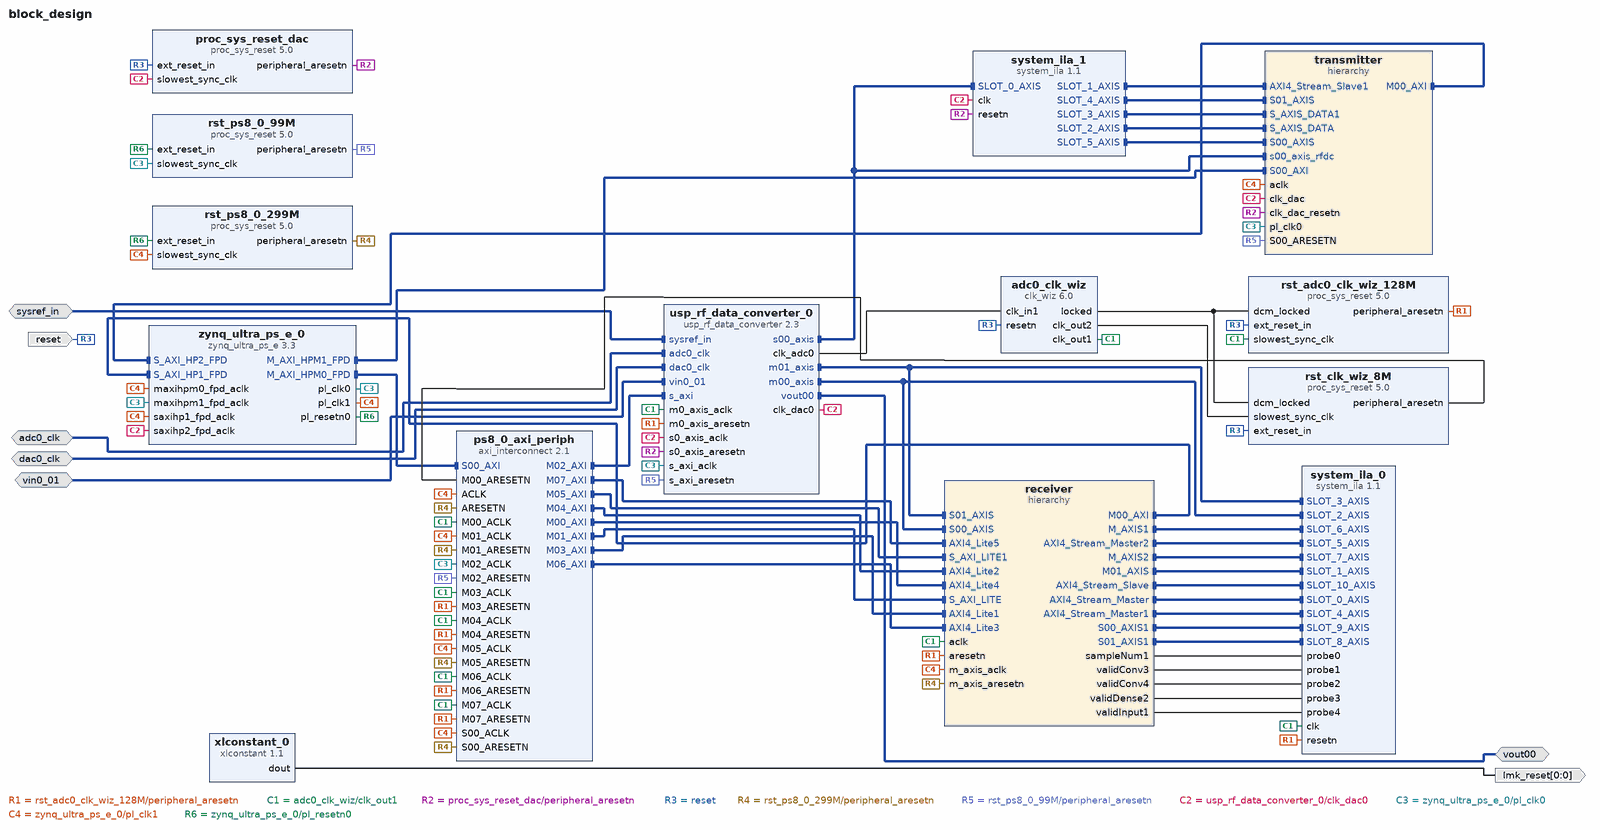
[diagram p0: block diagram of the top level]
# Vivado block design block_design, xczu28dr-ffvg1517-2-e, Vivado 2020.1
create_bd_design block_design

create_bd_intf_port -mode Slave -vlnv xilinx.com:interface:diff_clock_rtl:1.0 adc0_clk
set_property -dict {CONFIG.FREQ_HZ 409600000.0} [get_bd_intf_ports adc0_clk]
create_bd_intf_port -mode Slave -vlnv xilinx.com:interface:diff_clock_rtl:1.0 dac0_clk
set_property -dict {CONFIG.FREQ_HZ 409600000.0} [get_bd_intf_ports dac0_clk]
create_bd_intf_port -mode Slave -vlnv xilinx.com:display_usp_rf_data_converter:diff_pins_rtl:1.0 sysref_in
create_bd_intf_port -mode Slave -vlnv xilinx.com:interface:diff_analog_io_rtl:1.0 vin0_01
create_bd_intf_port -mode Master -vlnv xilinx.com:interface:diff_analog_io_rtl:1.0 vout00
create_bd_port -dir O -from 0 -to 0 lmk_reset
create_bd_port -dir I -type rst reset

create_bd_cell -type ip -vlnv xilinx.com:ip:clk_wiz:6.0 adc0_clk_wiz
set_property -dict [list \
  CONFIG.CLKOUT1_JITTER 135.584 \
  CONFIG.CLKOUT1_PHASE_ERROR 114.796 \
  CONFIG.CLKOUT1_REQUESTED_OUT_FREQ 128.000 \
  CONFIG.CLKOUT2_JITTER 251.912 \
  CONFIG.CLKOUT2_PHASE_ERROR 114.796 \
  CONFIG.CLKOUT2_REQUESTED_OUT_FREQ 8 \
  CONFIG.CLKOUT2_USED true \
  CONFIG.MMCM_CLKFBOUT_MULT_F 16.000 \
  CONFIG.MMCM_CLKOUT0_DIVIDE_F 8.000 \
  CONFIG.MMCM_CLKOUT1_DIVIDE 128 \
  CONFIG.NUM_OUT_CLKS 2 \
  CONFIG.PRIM_IN_FREQ 64.000 \
  CONFIG.RESET_PORT resetn \
  CONFIG.RESET_TYPE ACTIVE_LOW \
  CONFIG.USE_LOCKED true \
] [get_bd_cells adc0_clk_wiz]
create_bd_cell -type ip -vlnv xilinx.com:ip:proc_sys_reset:5.0 proc_sys_reset_dac
create_bd_cell -type ip -vlnv xilinx.com:ip:axi_interconnect:2.1 ps8_0_axi_periph
set_property -dict {CONFIG.NUM_MI 8} [get_bd_cells ps8_0_axi_periph]
create_bd_cell -type hier receiver
create_bd_cell -type ip -vlnv xilinx.com:ip:proc_sys_reset:5.0 rst_adc0_clk_wiz_128M
create_bd_cell -type ip -vlnv xilinx.com:ip:proc_sys_reset:5.0 rst_clk_wiz_8M
create_bd_cell -type ip -vlnv xilinx.com:ip:proc_sys_reset:5.0 rst_ps8_0_299M
create_bd_cell -type ip -vlnv xilinx.com:ip:proc_sys_reset:5.0 rst_ps8_0_99M
create_bd_cell -type ip -vlnv xilinx.com:ip:system_ila:1.1 system_ila_0
set_property -dict [list \
  CONFIG.C_DATA_DEPTH 4096 \
  CONFIG.C_MON_TYPE MIX \
  CONFIG.C_NUM_MONITOR_SLOTS 11 \
  CONFIG.C_NUM_OF_PROBES 5 \
  CONFIG.C_PROBE0_TYPE 0 \
  CONFIG.C_PROBE1_TYPE 0 \
  CONFIG.C_PROBE2_TYPE 0 \
  CONFIG.C_PROBE3_TYPE 0 \
  CONFIG.C_PROBE4_TYPE 0 \
  CONFIG.C_SLOT_0_APC_EN 0 \
  CONFIG.C_SLOT_0_AXI_DATA_SEL 1 \
  CONFIG.C_SLOT_0_AXI_TRIG_SEL 1 \
  CONFIG.C_SLOT_0_INTF_TYPE xilinx.com:interface:axis_rtl:1.0 \
  CONFIG.C_SLOT_10_APC_EN 0 \
  CONFIG.C_SLOT_10_AXI_DATA_SEL 1 \
  CONFIG.C_SLOT_10_AXI_TRIG_SEL 1 \
  CONFIG.C_SLOT_10_INTF_TYPE xilinx.com:interface:axis_rtl:1.0 \
  CONFIG.C_SLOT_1_APC_EN 0 \
  CONFIG.C_SLOT_1_AXI_DATA_SEL 1 \
  CONFIG.C_SLOT_1_AXI_TRIG_SEL 1 \
  CONFIG.C_SLOT_1_INTF_TYPE xilinx.com:interface:axis_rtl:1.0 \
  CONFIG.C_SLOT_2_APC_EN 0 \
  CONFIG.C_SLOT_2_AXI_DATA_SEL 1 \
  CONFIG.C_SLOT_2_AXI_TRIG_SEL 1 \
  CONFIG.C_SLOT_2_INTF_TYPE xilinx.com:interface:axis_rtl:1.0 \
  CONFIG.C_SLOT_3_APC_EN 0 \
  CONFIG.C_SLOT_3_AXI_DATA_SEL 1 \
  CONFIG.C_SLOT_3_AXI_TRIG_SEL 1 \
  CONFIG.C_SLOT_3_INTF_TYPE xilinx.com:interface:axis_rtl:1.0 \
  CONFIG.C_SLOT_4_APC_EN 0 \
  CONFIG.C_SLOT_4_AXI_DATA_SEL 1 \
  CONFIG.C_SLOT_4_AXI_TRIG_SEL 1 \
  CONFIG.C_SLOT_4_INTF_TYPE xilinx.com:interface:axis_rtl:1.0 \
  CONFIG.C_SLOT_5_APC_EN 0 \
  CONFIG.C_SLOT_5_AXI_DATA_SEL 1 \
  CONFIG.C_SLOT_5_AXI_TRIG_SEL 1 \
  CONFIG.C_SLOT_5_INTF_TYPE xilinx.com:interface:axis_rtl:1.0 \
  CONFIG.C_SLOT_6_APC_EN 0 \
  CONFIG.C_SLOT_6_AXI_DATA_SEL 1 \
  CONFIG.C_SLOT_6_AXI_TRIG_SEL 1 \
  CONFIG.C_SLOT_6_INTF_TYPE xilinx.com:interface:axis_rtl:1.0 \
  CONFIG.C_SLOT_7_APC_EN 0 \
  CONFIG.C_SLOT_7_AXI_DATA_SEL 1 \
  CONFIG.C_SLOT_7_AXI_TRIG_SEL 1 \
  CONFIG.C_SLOT_7_INTF_TYPE xilinx.com:interface:axis_rtl:1.0 \
  CONFIG.C_SLOT_8_APC_EN 0 \
  CONFIG.C_SLOT_8_AXI_DATA_SEL 1 \
  CONFIG.C_SLOT_8_AXI_TRIG_SEL 1 \
  CONFIG.C_SLOT_8_INTF_TYPE xilinx.com:interface:axis_rtl:1.0 \
  CONFIG.C_SLOT_9_APC_EN 0 \
  CONFIG.C_SLOT_9_AXI_DATA_SEL 1 \
  CONFIG.C_SLOT_9_AXI_TRIG_SEL 1 \
  CONFIG.C_SLOT_9_INTF_TYPE xilinx.com:interface:axis_rtl:1.0 \
] [get_bd_cells system_ila_0]
create_bd_cell -type ip -vlnv xilinx.com:ip:system_ila:1.1 system_ila_1
set_property -dict [list \
  CONFIG.C_MON_TYPE INTERFACE \
  CONFIG.C_NUM_MONITOR_SLOTS 6 \
  CONFIG.C_SLOT_0_APC_EN 0 \
  CONFIG.C_SLOT_0_AXI_DATA_SEL 1 \
  CONFIG.C_SLOT_0_AXI_TRIG_SEL 1 \
  CONFIG.C_SLOT_0_INTF_TYPE xilinx.com:interface:axis_rtl:1.0 \
  CONFIG.C_SLOT_1_APC_EN 0 \
  CONFIG.C_SLOT_1_AXI_DATA_SEL 1 \
  CONFIG.C_SLOT_1_AXI_TRIG_SEL 1 \
  CONFIG.C_SLOT_1_INTF_TYPE xilinx.com:interface:axis_rtl:1.0 \
  CONFIG.C_SLOT_2_APC_EN 0 \
  CONFIG.C_SLOT_2_AXI_DATA_SEL 1 \
  CONFIG.C_SLOT_2_AXI_TRIG_SEL 1 \
  CONFIG.C_SLOT_2_INTF_TYPE xilinx.com:interface:axis_rtl:1.0 \
  CONFIG.C_SLOT_3_APC_EN 0 \
  CONFIG.C_SLOT_3_AXI_DATA_SEL 1 \
  CONFIG.C_SLOT_3_AXI_TRIG_SEL 1 \
  CONFIG.C_SLOT_3_INTF_TYPE xilinx.com:interface:axis_rtl:1.0 \
  CONFIG.C_SLOT_4_APC_EN 0 \
  CONFIG.C_SLOT_4_AXI_DATA_SEL 1 \
  CONFIG.C_SLOT_4_AXI_TRIG_SEL 1 \
  CONFIG.C_SLOT_4_INTF_TYPE xilinx.com:interface:axis_rtl:1.0 \
  CONFIG.C_SLOT_5_APC_EN 0 \
  CONFIG.C_SLOT_5_AXI_DATA_SEL 1 \
  CONFIG.C_SLOT_5_AXI_TRIG_SEL 1 \
  CONFIG.C_SLOT_5_INTF_TYPE xilinx.com:interface:axis_rtl:1.0 \
] [get_bd_cells system_ila_1]
create_bd_cell -type hier transmitter
create_bd_cell -type ip -vlnv xilinx.com:ip:usp_rf_data_converter:2.3 usp_rf_data_converter_0
set_property -dict [list \
  CONFIG.ADC0_Outclk_Freq 64.000 \
  CONFIG.ADC0_PLL_Enable true \
  CONFIG.ADC0_Refclk_Freq 409.600 \
  CONFIG.ADC0_Sampling_Rate 1.024 \
  CONFIG.ADC_Data_Type00 1 \
  CONFIG.ADC_Data_Width00 1 \
  CONFIG.ADC_Decimation_Mode00 8 \
  CONFIG.ADC_Dither00 false \
  CONFIG.ADC_Mixer_Mode00 0 \
  CONFIG.ADC_Mixer_Type00 1 \
  CONFIG.ADC_Mixer_Type01 1 \
  CONFIG.ADC_Slice00_Enable true \
  CONFIG.DAC0_Outclk_Freq 128.000 \
  CONFIG.DAC0_PLL_Enable true \
  CONFIG.DAC0_Refclk_Freq 409.600 \
  CONFIG.DAC0_Sampling_Rate 1.024 \
  CONFIG.DAC_Data_Width00 2 \
  CONFIG.DAC_Interpolation_Mode00 8 \
  CONFIG.DAC_Mixer_Mode00 0 \
  CONFIG.DAC_Mixer_Type00 2 \
  CONFIG.DAC_Slice00_Enable true \
  CONFIG.DAC_Slice01_Enable false \
  CONFIG.DAC_Slice10_Enable false \
  CONFIG.DAC_Slice12_Enable false \
  CONFIG.DAC_Slice13_Enable false \
] [get_bd_cells usp_rf_data_converter_0]
create_bd_cell -type ip -vlnv xilinx.com:ip:xlconstant:1.1 xlconstant_0
set_property -dict {CONFIG.CONST_VAL 0} [get_bd_cells xlconstant_0]
create_bd_cell -type ip -vlnv xilinx.com:ip:zynq_ultra_ps_e:3.3 zynq_ultra_ps_e_0
set_property -dict [list \
  CONFIG.CAN0_BOARD_INTERFACE custom \
  CONFIG.CAN1_BOARD_INTERFACE custom \
  CONFIG.CSU_BOARD_INTERFACE custom \
  CONFIG.DP_BOARD_INTERFACE custom \
  CONFIG.GEM0_BOARD_INTERFACE custom \
  CONFIG.GEM1_BOARD_INTERFACE custom \
  CONFIG.GEM2_BOARD_INTERFACE custom \
  CONFIG.GEM3_BOARD_INTERFACE custom \
  CONFIG.GPIO_BOARD_INTERFACE custom \
  CONFIG.IIC0_BOARD_INTERFACE custom \
  CONFIG.IIC1_BOARD_INTERFACE custom \
  CONFIG.NAND_BOARD_INTERFACE custom \
  CONFIG.PCIE_BOARD_INTERFACE custom \
  CONFIG.PJTAG_BOARD_INTERFACE custom \
  CONFIG.PMU_BOARD_INTERFACE custom \
  CONFIG.PSU_BANK_0_IO_STANDARD LVCMOS18 \
  CONFIG.PSU_BANK_1_IO_STANDARD LVCMOS18 \
  CONFIG.PSU_BANK_2_IO_STANDARD LVCMOS18 \
  CONFIG.PSU_BANK_3_IO_STANDARD LVCMOS33 \
  CONFIG.PSU_USB3__DUAL_CLOCK_ENABLE 1 \
  CONFIG.PSU__CAN1__PERIPHERAL__ENABLE 0 \
  CONFIG.PSU__CRF_APB__ACPU_CTRL__FREQMHZ 1200 \
  CONFIG.PSU__CRF_APB__ACPU_CTRL__SRCSEL APLL \
  CONFIG.PSU__CRF_APB__APLL_CTRL__SRCSEL PSS_REF_CLK \
  CONFIG.PSU__CRF_APB__DBG_FPD_CTRL__FREQMHZ 250 \
  CONFIG.PSU__CRF_APB__DBG_FPD_CTRL__SRCSEL IOPLL \
  CONFIG.PSU__CRF_APB__DBG_TRACE_CTRL__FREQMHZ 250 \
  CONFIG.PSU__CRF_APB__DBG_TRACE_CTRL__SRCSEL IOPLL \
  CONFIG.PSU__CRF_APB__DBG_TSTMP_CTRL__FREQMHZ 250 \
  CONFIG.PSU__CRF_APB__DBG_TSTMP_CTRL__SRCSEL IOPLL \
  CONFIG.PSU__CRF_APB__DDR_CTRL__FREQMHZ 1067 \
  CONFIG.PSU__CRF_APB__DDR_CTRL__SRCSEL DPLL \
  CONFIG.PSU__CRF_APB__DPDMA_REF_CTRL__FREQMHZ 600 \
  CONFIG.PSU__CRF_APB__DPDMA_REF_CTRL__SRCSEL APLL \
  CONFIG.PSU__CRF_APB__DPLL_CTRL__SRCSEL PSS_REF_CLK \
  CONFIG.PSU__CRF_APB__DP_AUDIO_REF_CTRL__SRCSEL RPLL \
  CONFIG.PSU__CRF_APB__DP_STC_REF_CTRL__SRCSEL RPLL \
  CONFIG.PSU__CRF_APB__DP_VIDEO_REF_CTRL__SRCSEL VPLL \
  CONFIG.PSU__CRF_APB__GDMA_REF_CTRL__FREQMHZ 600 \
  CONFIG.PSU__CRF_APB__GDMA_REF_CTRL__SRCSEL APLL \
  CONFIG.PSU__CRF_APB__GPU_REF_CTRL__FREQMHZ 500 \
  CONFIG.PSU__CRF_APB__GPU_REF_CTRL__SRCSEL IOPLL \
  CONFIG.PSU__CRF_APB__TOPSW_LSBUS_CTRL__FREQMHZ 100 \
  CONFIG.PSU__CRF_APB__TOPSW_LSBUS_CTRL__SRCSEL IOPLL \
  CONFIG.PSU__CRF_APB__TOPSW_MAIN_CTRL__FREQMHZ 533.33 \
  CONFIG.PSU__CRF_APB__TOPSW_MAIN_CTRL__SRCSEL DPLL \
  CONFIG.PSU__CRF_APB__VPLL_CTRL__SRCSEL PSS_REF_CLK \
  CONFIG.PSU__CRL_APB__ADMA_REF_CTRL__FREQMHZ 500 \
  CONFIG.PSU__CRL_APB__ADMA_REF_CTRL__SRCSEL IOPLL \
  CONFIG.PSU__CRL_APB__CAN1_REF_CTRL__FREQMHZ 100 \
  CONFIG.PSU__CRL_APB__CAN1_REF_CTRL__SRCSEL IOPLL \
  CONFIG.PSU__CRL_APB__CPU_R5_CTRL__FREQMHZ 500 \
  CONFIG.PSU__CRL_APB__CPU_R5_CTRL__SRCSEL IOPLL \
  CONFIG.PSU__CRL_APB__DBG_LPD_CTRL__FREQMHZ 250 \
  CONFIG.PSU__CRL_APB__DBG_LPD_CTRL__SRCSEL IOPLL \
  CONFIG.PSU__CRL_APB__GEM3_REF_CTRL__FREQMHZ 125 \
  CONFIG.PSU__CRL_APB__GEM3_REF_CTRL__SRCSEL IOPLL \
  CONFIG.PSU__CRL_APB__I2C0_REF_CTRL__FREQMHZ 100 \
  CONFIG.PSU__CRL_APB__I2C0_REF_CTRL__SRCSEL IOPLL \
  CONFIG.PSU__CRL_APB__I2C1_REF_CTRL__FREQMHZ 100 \
  CONFIG.PSU__CRL_APB__I2C1_REF_CTRL__SRCSEL IOPLL \
  CONFIG.PSU__CRL_APB__IOPLL_CTRL__SRCSEL PSS_REF_CLK \
  CONFIG.PSU__CRL_APB__IOU_SWITCH_CTRL__FREQMHZ 250 \
  CONFIG.PSU__CRL_APB__IOU_SWITCH_CTRL__SRCSEL IOPLL \
  CONFIG.PSU__CRL_APB__LPD_LSBUS_CTRL__FREQMHZ 100 \
  CONFIG.PSU__CRL_APB__LPD_LSBUS_CTRL__SRCSEL IOPLL \
  CONFIG.PSU__CRL_APB__LPD_SWITCH_CTRL__FREQMHZ 500 \
  CONFIG.PSU__CRL_APB__LPD_SWITCH_CTRL__SRCSEL IOPLL \
  CONFIG.PSU__CRL_APB__PCAP_CTRL__FREQMHZ 200 \
  CONFIG.PSU__CRL_APB__PCAP_CTRL__SRCSEL IOPLL \
  CONFIG.PSU__CRL_APB__PL0_REF_CTRL__FREQMHZ 100 \
  CONFIG.PSU__CRL_APB__PL0_REF_CTRL__SRCSEL IOPLL \
  CONFIG.PSU__CRL_APB__PL1_REF_CTRL__FREQMHZ 300 \
  CONFIG.PSU__CRL_APB__PL1_REF_CTRL__SRCSEL IOPLL \
  CONFIG.PSU__CRL_APB__QSPI_REF_CTRL__FREQMHZ 125 \
  CONFIG.PSU__CRL_APB__QSPI_REF_CTRL__SRCSEL IOPLL \
  CONFIG.PSU__CRL_APB__RPLL_CTRL__SRCSEL PSS_REF_CLK \
  CONFIG.PSU__CRL_APB__SDIO1_REF_CTRL__FREQMHZ 200 \
  CONFIG.PSU__CRL_APB__SDIO1_REF_CTRL__SRCSEL IOPLL \
  CONFIG.PSU__CRL_APB__TIMESTAMP_REF_CTRL__FREQMHZ 100 \
  CONFIG.PSU__CRL_APB__TIMESTAMP_REF_CTRL__SRCSEL IOPLL \
  CONFIG.PSU__CRL_APB__UART0_REF_CTRL__FREQMHZ 100 \
  CONFIG.PSU__CRL_APB__UART0_REF_CTRL__SRCSEL IOPLL \
  CONFIG.PSU__CRL_APB__UART1_REF_CTRL__FREQMHZ 100 \
  CONFIG.PSU__CRL_APB__UART1_REF_CTRL__SRCSEL IOPLL \
  CONFIG.PSU__CRL_APB__USB0_BUS_REF_CTRL__FREQMHZ 250 \
  CONFIG.PSU__CRL_APB__USB0_BUS_REF_CTRL__SRCSEL IOPLL \
  CONFIG.PSU__CRL_APB__USB3_DUAL_REF_CTRL__FREQMHZ 20 \
  CONFIG.PSU__CRL_APB__USB3_DUAL_REF_CTRL__SRCSEL IOPLL \
  CONFIG.PSU__CRL_APB__USB3__ENABLE 1 \
  CONFIG.PSU__CSUPMU__PERIPHERAL__VALID 1 \
  CONFIG.PSU__DDRC__BUS_WIDTH {64 Bit} \
  CONFIG.PSU__DDRC__COMPONENTS UDIMM \
  CONFIG.PSU__DDRC__DEVICE_CAPACITY {8192 MBits} \
  CONFIG.PSU__DDRC__DRAM_WIDTH {16 Bits} \
  CONFIG.PSU__DDRC__ECC Disabled \
  CONFIG.PSU__DDRC__MEMORY_TYPE {DDR 4} \
  CONFIG.PSU__DDRC__SPEED_BIN DDR4_2133P \
  CONFIG.PSU__DDR_HIGH_ADDRESS_GUI_ENABLE 1 \
  CONFIG.PSU__DDR__INTERFACE__FREQMHZ 533.500 \
  CONFIG.PSU__DEVICE_TYPE RFSOC \
  CONFIG.PSU__DISPLAYPORT__LANE0__ENABLE 1 \
  CONFIG.PSU__DISPLAYPORT__LANE0__IO {GT Lane1} \
  CONFIG.PSU__DISPLAYPORT__LANE1__ENABLE 1 \
  CONFIG.PSU__DISPLAYPORT__LANE1__IO {GT Lane0} \
  CONFIG.PSU__DISPLAYPORT__PERIPHERAL__ENABLE 1 \
  CONFIG.PSU__DLL__ISUSED 1 \
  CONFIG.PSU__DPAUX__PERIPHERAL__ENABLE 1 \
  CONFIG.PSU__DPAUX__PERIPHERAL__IO {MIO 27 .. 30} \
  CONFIG.PSU__DP__LANE_SEL {Dual Lower} \
  CONFIG.PSU__DP__REF_CLK_FREQ 27 \
  CONFIG.PSU__DP__REF_CLK_SEL {Ref Clk1} \
  CONFIG.PSU__ENET3__FIFO__ENABLE 0 \
  CONFIG.PSU__ENET3__GRP_MDIO__ENABLE 1 \
  CONFIG.PSU__ENET3__GRP_MDIO__IO {MIO 76 .. 77} \
  CONFIG.PSU__ENET3__PERIPHERAL__ENABLE 1 \
  CONFIG.PSU__ENET3__PERIPHERAL__IO {MIO 64 .. 75} \
  CONFIG.PSU__ENET3__PTP__ENABLE 0 \
  CONFIG.PSU__ENET3__TSU__ENABLE 0 \
  CONFIG.PSU__FPGA_PL0_ENABLE 1 \
  CONFIG.PSU__FPGA_PL1_ENABLE 1 \
  CONFIG.PSU__GEM3_COHERENCY 0 \
  CONFIG.PSU__GEM3_ROUTE_THROUGH_FPD 0 \
  CONFIG.PSU__GEM__TSU__ENABLE 0 \
  CONFIG.PSU__GPIO0_MIO__IO {MIO 0 .. 25} \
  CONFIG.PSU__GPIO0_MIO__PERIPHERAL__ENABLE 1 \
  CONFIG.PSU__GPIO1_MIO__IO {MIO 26 .. 51} \
  CONFIG.PSU__GPIO1_MIO__PERIPHERAL__ENABLE 1 \
  CONFIG.PSU__GPU_PP0__POWER__ON 0 \
  CONFIG.PSU__GPU_PP1__POWER__ON 0 \
  CONFIG.PSU__GT__LINK_SPEED HBR \
  CONFIG.PSU__GT__PRE_EMPH_LVL_4 0 \
  CONFIG.PSU__GT__VLT_SWNG_LVL_4 0 \
  CONFIG.PSU__I2C0__PERIPHERAL__ENABLE 1 \
  CONFIG.PSU__I2C0__PERIPHERAL__IO {MIO 14 .. 15} \
  CONFIG.PSU__I2C1__PERIPHERAL__ENABLE 1 \
  CONFIG.PSU__I2C1__PERIPHERAL__IO {MIO 16 .. 17} \
  CONFIG.PSU__IOU_SLCR__IOU_TTC_APB_CLK__TTC0_SEL APB \
  CONFIG.PSU__IOU_SLCR__IOU_TTC_APB_CLK__TTC1_SEL APB \
  CONFIG.PSU__IOU_SLCR__IOU_TTC_APB_CLK__TTC2_SEL APB \
  CONFIG.PSU__IOU_SLCR__IOU_TTC_APB_CLK__TTC3_SEL APB \
  CONFIG.PSU__MAXIGP0__DATA_WIDTH 128 \
  CONFIG.PSU__OVERRIDE__BASIC_CLOCK 0 \
  CONFIG.PSU__PMU_COHERENCY 0 \
  CONFIG.PSU__PMU__AIBACK__ENABLE 0 \
  CONFIG.PSU__PMU__EMIO_GPI__ENABLE 0 \
  CONFIG.PSU__PMU__EMIO_GPO__ENABLE 0 \
  CONFIG.PSU__PMU__GPI0__ENABLE 0 \
  CONFIG.PSU__PMU__GPI1__ENABLE 0 \
  CONFIG.PSU__PMU__GPI2__ENABLE 0 \
  CONFIG.PSU__PMU__GPI3__ENABLE 0 \
  CONFIG.PSU__PMU__GPI4__ENABLE 0 \
  CONFIG.PSU__PMU__GPI5__ENABLE 0 \
  CONFIG.PSU__PMU__GPO0__ENABLE 1 \
  CONFIG.PSU__PMU__GPO0__IO {MIO 32} \
  CONFIG.PSU__PMU__GPO1__ENABLE 1 \
  CONFIG.PSU__PMU__GPO1__IO {MIO 33} \
  CONFIG.PSU__PMU__GPO2__ENABLE 1 \
  CONFIG.PSU__PMU__GPO2__IO {MIO 34} \
  CONFIG.PSU__PMU__GPO2__POLARITY low \
  CONFIG.PSU__PMU__GPO3__ENABLE 1 \
  CONFIG.PSU__PMU__GPO3__IO {MIO 35} \
  CONFIG.PSU__PMU__GPO3__POLARITY low \
  CONFIG.PSU__PMU__GPO4__ENABLE 1 \
  CONFIG.PSU__PMU__GPO4__IO {MIO 36} \
  CONFIG.PSU__PMU__GPO4__POLARITY low \
  CONFIG.PSU__PMU__GPO5__ENABLE 1 \
  CONFIG.PSU__PMU__GPO5__IO {MIO 37} \
  CONFIG.PSU__PMU__GPO5__POLARITY low \
  CONFIG.PSU__PMU__PERIPHERAL__ENABLE 1 \
  CONFIG.PSU__PMU__PLERROR__ENABLE 0 \
  CONFIG.PSU__PRESET_APPLIED 1 \
  CONFIG.PSU__PSS_REF_CLK__FREQMHZ 33.333 \
  CONFIG.PSU__QSPI_COHERENCY 0 \
  CONFIG.PSU__QSPI_ROUTE_THROUGH_FPD 0 \
  CONFIG.PSU__QSPI__GRP_FBCLK__ENABLE 1 \
  CONFIG.PSU__QSPI__GRP_FBCLK__IO {MIO 6} \
  CONFIG.PSU__QSPI__PERIPHERAL__DATA_MODE x4 \
  CONFIG.PSU__QSPI__PERIPHERAL__ENABLE 1 \
  CONFIG.PSU__QSPI__PERIPHERAL__IO {MIO 0 .. 12} \
  CONFIG.PSU__QSPI__PERIPHERAL__MODE {Dual Parallel} \
  CONFIG.PSU__SATA__LANE1__IO {GT Lane3} \
  CONFIG.PSU__SATA__PERIPHERAL__ENABLE 1 \
  CONFIG.PSU__SATA__REF_CLK_FREQ 125 \
  CONFIG.PSU__SATA__REF_CLK_SEL {Ref Clk3} \
  CONFIG.PSU__SD1_COHERENCY 0 \
  CONFIG.PSU__SD1_ROUTE_THROUGH_FPD 0 \
  CONFIG.PSU__SD1__DATA_TRANSFER_MODE 8Bit \
  CONFIG.PSU__SD1__GRP_CD__ENABLE 1 \
  CONFIG.PSU__SD1__GRP_CD__IO {MIO 45} \
  CONFIG.PSU__SD1__GRP_POW__ENABLE 0 \
  CONFIG.PSU__SD1__GRP_WP__ENABLE 0 \
  CONFIG.PSU__SD1__PERIPHERAL__ENABLE 1 \
  CONFIG.PSU__SD1__PERIPHERAL__IO {MIO 39 .. 51} \
  CONFIG.PSU__SD1__SLOT_TYPE {SD 3.0} \
  CONFIG.PSU__SWDT0__CLOCK__ENABLE 0 \
  CONFIG.PSU__SWDT0__PERIPHERAL__ENABLE 1 \
  CONFIG.PSU__SWDT0__RESET__ENABLE 0 \
  CONFIG.PSU__SWDT1__CLOCK__ENABLE 0 \
  CONFIG.PSU__SWDT1__PERIPHERAL__ENABLE 1 \
  CONFIG.PSU__SWDT1__RESET__ENABLE 0 \
  CONFIG.PSU__TSU__BUFG_PORT_PAIR 0 \
  CONFIG.PSU__TTC0__CLOCK__ENABLE 0 \
  CONFIG.PSU__TTC0__PERIPHERAL__ENABLE 1 \
  CONFIG.PSU__TTC0__WAVEOUT__ENABLE 0 \
  CONFIG.PSU__TTC1__CLOCK__ENABLE 0 \
  CONFIG.PSU__TTC1__PERIPHERAL__ENABLE 1 \
  CONFIG.PSU__TTC1__WAVEOUT__ENABLE 0 \
  CONFIG.PSU__TTC2__CLOCK__ENABLE 0 \
  CONFIG.PSU__TTC2__PERIPHERAL__ENABLE 1 \
  CONFIG.PSU__TTC2__WAVEOUT__ENABLE 0 \
  CONFIG.PSU__TTC3__CLOCK__ENABLE 0 \
  CONFIG.PSU__TTC3__PERIPHERAL__ENABLE 1 \
  CONFIG.PSU__TTC3__WAVEOUT__ENABLE 0 \
  CONFIG.PSU__UART0__BAUD_RATE 115200 \
  CONFIG.PSU__UART0__MODEM__ENABLE 0 \
  CONFIG.PSU__UART0__PERIPHERAL__ENABLE 1 \
  CONFIG.PSU__UART0__PERIPHERAL__IO {MIO 18 .. 19} \
  CONFIG.PSU__UART1__PERIPHERAL__ENABLE 0 \
  CONFIG.PSU__USB0_COHERENCY 0 \
  CONFIG.PSU__USB0__PERIPHERAL__ENABLE 1 \
  CONFIG.PSU__USB0__PERIPHERAL__IO {MIO 52 .. 63} \
  CONFIG.PSU__USB0__REF_CLK_FREQ 26 \
  CONFIG.PSU__USB0__REF_CLK_SEL {Ref Clk2} \
  CONFIG.PSU__USB2_0__EMIO__ENABLE 0 \
  CONFIG.PSU__USB3_0__EMIO__ENABLE 0 \
  CONFIG.PSU__USB3_0__PERIPHERAL__ENABLE 1 \
  CONFIG.PSU__USB3_0__PERIPHERAL__IO {GT Lane2} \
  CONFIG.PSU__USB__RESET__MODE {Boot Pin} \
  CONFIG.PSU__USB__RESET__POLARITY {Active Low} \
  CONFIG.PSU__USE__IRQ0 1 \
  CONFIG.PSU__USE__M_AXI_GP0 1 \
  CONFIG.PSU__USE__M_AXI_GP1 1 \
  CONFIG.PSU__USE__M_AXI_GP2 0 \
  CONFIG.PSU__USE__S_AXI_GP3 1 \
  CONFIG.PSU__USE__S_AXI_GP4 1 \
  CONFIG.QSPI_BOARD_INTERFACE custom \
  CONFIG.SATA_BOARD_INTERFACE custom \
  CONFIG.SD0_BOARD_INTERFACE custom \
  CONFIG.SD1_BOARD_INTERFACE custom \
  CONFIG.SPI0_BOARD_INTERFACE custom \
  CONFIG.SPI1_BOARD_INTERFACE custom \
  CONFIG.SUBPRESET1 Custom \
  CONFIG.SUBPRESET2 Custom \
  CONFIG.SWDT0_BOARD_INTERFACE custom \
  CONFIG.SWDT1_BOARD_INTERFACE custom \
  CONFIG.TRACE_BOARD_INTERFACE custom \
  CONFIG.TTC0_BOARD_INTERFACE custom \
  CONFIG.TTC1_BOARD_INTERFACE custom \
  CONFIG.TTC2_BOARD_INTERFACE custom \
  CONFIG.TTC3_BOARD_INTERFACE custom \
  CONFIG.UART0_BOARD_INTERFACE custom \
  CONFIG.UART1_BOARD_INTERFACE custom \
  CONFIG.USB0_BOARD_INTERFACE custom \
  CONFIG.USB1_BOARD_INTERFACE custom \
] [get_bd_cells zynq_ultra_ps_e_0]
# 737 more settings of zynq_ultra_ps_e_0 are not shown: defaults, MIO pin electricals, DDR timing, and values the tool derives

# ---- hierarchy /receiver ----
current_bd_instance /receiver
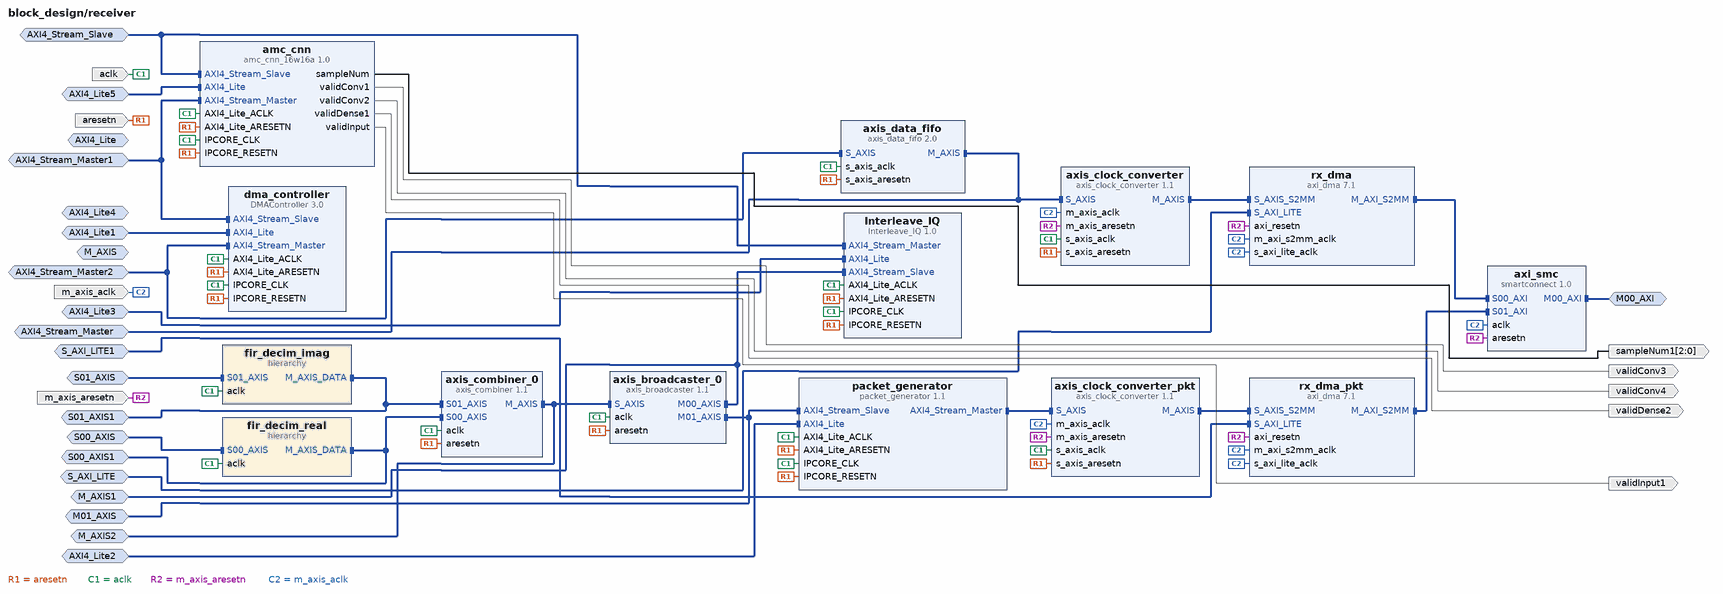
[diagram p1: block diagram inside /receiver]
create_bd_intf_pin -mode Slave -vlnv xilinx.com:interface:aximm_rtl:1.0 AXI4_Lite
create_bd_intf_pin -mode Slave -vlnv xilinx.com:interface:aximm_rtl:1.0 AXI4_Lite1
create_bd_intf_pin -mode Slave -vlnv xilinx.com:interface:aximm_rtl:1.0 AXI4_Lite2
create_bd_intf_pin -mode Slave -vlnv xilinx.com:interface:aximm_rtl:1.0 AXI4_Lite3
create_bd_intf_pin -mode Slave -vlnv xilinx.com:interface:aximm_rtl:1.0 AXI4_Lite4
create_bd_intf_pin -mode Slave -vlnv xilinx.com:interface:aximm_rtl:1.0 AXI4_Lite5
create_bd_intf_pin -mode Monitor -vlnv xilinx.com:interface:axis_rtl:1.0 AXI4_Stream_Master
create_bd_intf_pin -mode Monitor -vlnv xilinx.com:interface:axis_rtl:1.0 AXI4_Stream_Master1
create_bd_intf_pin -mode Monitor -vlnv xilinx.com:interface:axis_rtl:1.0 AXI4_Stream_Master2
create_bd_intf_pin -mode Monitor -vlnv xilinx.com:interface:axis_rtl:1.0 AXI4_Stream_Slave
create_bd_intf_pin -mode Master -vlnv xilinx.com:interface:aximm_rtl:1.0 M00_AXI
create_bd_intf_pin -mode Monitor -vlnv xilinx.com:interface:axis_rtl:1.0 M01_AXIS
create_bd_intf_pin -mode Monitor -vlnv xilinx.com:interface:axis_rtl:1.0 M_AXIS
create_bd_intf_pin -mode Monitor -vlnv xilinx.com:interface:axis_rtl:1.0 M_AXIS1
create_bd_intf_pin -mode Monitor -vlnv xilinx.com:interface:axis_rtl:1.0 M_AXIS2
create_bd_intf_pin -mode Slave -vlnv xilinx.com:interface:axis_rtl:1.0 S00_AXIS
create_bd_intf_pin -mode Monitor -vlnv xilinx.com:interface:axis_rtl:1.0 S00_AXIS1
create_bd_intf_pin -mode Slave -vlnv xilinx.com:interface:axis_rtl:1.0 S01_AXIS
create_bd_intf_pin -mode Monitor -vlnv xilinx.com:interface:axis_rtl:1.0 S01_AXIS1
create_bd_intf_pin -mode Slave -vlnv xilinx.com:interface:aximm_rtl:1.0 S_AXI_LITE
create_bd_intf_pin -mode Slave -vlnv xilinx.com:interface:aximm_rtl:1.0 S_AXI_LITE1
create_bd_pin -dir I -type clk aclk
create_bd_pin -dir I -type rst aresetn
create_bd_pin -dir I -type clk m_axis_aclk
create_bd_pin -dir I -type rst m_axis_aresetn
create_bd_pin -dir O -from 2 -to 0 sampleNum1
create_bd_pin -dir O validConv3
create_bd_pin -dir O validConv4
create_bd_pin -dir O validDense2
create_bd_pin -dir O validInput1

create_bd_cell -type ip -vlnv user.org:ip:Interleave_IQ:1.0 Interleave_IQ
create_bd_cell -type ip -vlnv user.org:ip:amc_cnn_16w16a:1.0 amc_cnn
create_bd_cell -type ip -vlnv xilinx.com:ip:smartconnect:1.0 axi_smc
set_property -dict {CONFIG.NUM_SI 2} [get_bd_cells axi_smc]
create_bd_cell -type ip -vlnv xilinx.com:ip:axis_broadcaster:1.1 axis_broadcaster_0
set_property -dict [list \
  CONFIG.M00_TDATA_REMAP {tdata[31:0]} \
  CONFIG.M01_TDATA_REMAP {tdata[31:0]} \
  CONFIG.M_TDATA_NUM_BYTES 4 \
  CONFIG.S_TDATA_NUM_BYTES 4 \
] [get_bd_cells axis_broadcaster_0]
create_bd_cell -type ip -vlnv xilinx.com:ip:axis_clock_converter:1.1 axis_clock_converter
set_property -dict {CONFIG.SYNCHRONIZATION_STAGES 5} [get_bd_cells axis_clock_converter]
create_bd_cell -type ip -vlnv xilinx.com:ip:axis_clock_converter:1.1 axis_clock_converter_pkt
set_property -dict {CONFIG.SYNCHRONIZATION_STAGES 5} [get_bd_cells axis_clock_converter_pkt]
create_bd_cell -type ip -vlnv xilinx.com:ip:axis_combiner:1.1 axis_combiner_0
create_bd_cell -type ip -vlnv xilinx.com:ip:axis_data_fifo:2.0 axis_data_fifo
set_property -dict {CONFIG.FIFO_DEPTH 16 CONFIG.FIFO_MODE 2} [get_bd_cells axis_data_fifo]
create_bd_cell -type ip -vlnv user.org:ip:DMAController:3.0 dma_controller
create_bd_cell -type hier fir_decim_imag
create_bd_cell -type hier fir_decim_real
create_bd_cell -type ip -vlnv user.org:ip:packet_generator:1.1 packet_generator
create_bd_cell -type ip -vlnv xilinx.com:ip:axi_dma:7.1 rx_dma
set_property -dict [list \
  CONFIG.c_addr_width 64 \
  CONFIG.c_include_mm2s 0 \
  CONFIG.c_include_s2mm 1 \
  CONFIG.c_include_s2mm_dre 0 \
  CONFIG.c_include_sg 0 \
  CONFIG.c_s2mm_burst_size 8 \
  CONFIG.c_sg_length_width 26 \
] [get_bd_cells rx_dma]
create_bd_cell -type ip -vlnv xilinx.com:ip:axi_dma:7.1 rx_dma_pkt
set_property -dict [list \
  CONFIG.c_addr_width 64 \
  CONFIG.c_include_mm2s 0 \
  CONFIG.c_include_s2mm 1 \
  CONFIG.c_include_s2mm_dre 0 \
  CONFIG.c_include_sg 0 \
  CONFIG.c_s2mm_burst_size 256 \
  CONFIG.c_sg_length_width 26 \
] [get_bd_cells rx_dma_pkt]

# ---- hierarchy /receiver/fir_decim_imag ----
current_bd_instance /receiver/fir_decim_imag
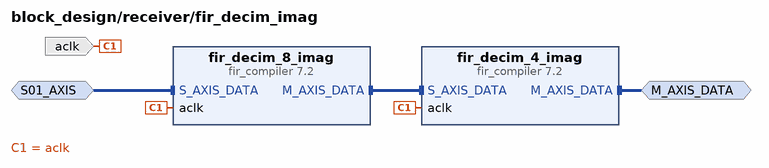
[diagram p2: block diagram inside /receiver/fir_decim_imag]
create_bd_intf_pin -mode Master -vlnv xilinx.com:interface:axis_rtl:1.0 M_AXIS_DATA
create_bd_intf_pin -mode Slave -vlnv xilinx.com:interface:axis_rtl:1.0 S01_AXIS
create_bd_pin -dir I -type clk aclk

create_bd_cell -type ip -vlnv xilinx.com:ip:fir_compiler:7.2 fir_decim_4_imag
set_property -dict [list \
  CONFIG.BestPrecision true \
  CONFIG.Clock_Frequency 128 \
  CONFIG.CoefficientVector 0,-2.23552328177445e-05,-5.02691722712620e-05,-5.27936575865503e-05,0,0.000102562320484404,0.000193518853328241,0.000178689228436154,0,-0.000289593226472151,-0.000510701382131011,-0.000445176118540556,0,0.000656923507701932,0.00111427702915062,0.000938038371079250,0,-0.00130364620573421,-0.00215450686978872,-0.00177113290780785,0,0.00236071174213220,0.00383053586619311,0.00309637406557559,0,-0.00400748011041086,-0.00642065997604389,-0.00513143273038007,0,0.00651823856781384,0.0103677968692248,0.00823850428282832,0,-0.0103980502168667,-0.0165345856384015,-0.0131662230791404,0,0.0168352717196640,0.0271009532955774,0.0219590024846825,0,-0.0297291260868043,-0.0500855011751722,-0.0432546200357644,0,0.0739578385289039,0.158144024162812,0.224720918739019,0.250000000000000,0.224720918739019,0.158144024162812,0.0739578385289039,0,-0.0432546200357644,-0.0500855011751722,-0.0297291260868043,0,0.0219590024846825,0.0271009532955774,0.0168352717196640,0,-0.0131662230791404,-0.0165345856384015,-0.0103980502168667,0,0.00823850428282832,0.0103677968692248,0.00651823856781384,0,-0.00513143273038007,-0.00642065997604389,-0.00400748011041086,0,0.00309637406557559,0.00383053586619311,0.00236071174213220,0,-0.00177113290780785,-0.00215450686978872,-0.00130364620573421,0,0.000938038371079250,0.00111427702915062,0.000656923507701932,0,-0.000445176118540556,-0.000510701382131011,-0.000289593226472151,0,0.000178689228436154,0.000193518853328241,0.000102562320484404,0,-5.27936575865503e-05,-5.02691722712620e-05,-2.23552328177445e-05,0 \
  CONFIG.Coefficient_Fractional_Bits 16 \
  CONFIG.Coefficient_Sets 1 \
  CONFIG.Coefficient_Sign Signed \
  CONFIG.Coefficient_Structure Inferred \
  CONFIG.Coefficient_Width 16 \
  CONFIG.ColumnConfig 2 \
  CONFIG.Decimation_Rate 4 \
  CONFIG.Filter_Architecture Systolic_Multiply_Accumulate \
  CONFIG.Filter_Type Decimation \
  CONFIG.Interpolation_Rate 1 \
  CONFIG.Number_Channels 1 \
  CONFIG.Output_Rounding_Mode Truncate_LSBs \
  CONFIG.Output_Width 16 \
  CONFIG.Quantization Quantize_Only \
  CONFIG.RateSpecification Frequency_Specification \
  CONFIG.S_DATA_Has_FIFO false \
  CONFIG.Sample_Frequency 16 \
  CONFIG.Zero_Pack_Factor 1 \
] [get_bd_cells fir_decim_4_imag]
create_bd_cell -type ip -vlnv xilinx.com:ip:fir_compiler:7.2 fir_decim_8_imag
set_property -dict [list \
  CONFIG.BestPrecision true \
  CONFIG.Clock_Frequency 128 \
  CONFIG.CoefficientVector 0,-4.61831139920519e-06,-1.11776164088723e-05,-1.86102645020054e-05,-2.51345861356310e-05,-2.84942816906662e-05,-2.63968287932752e-05,-1.70942125588022e-05,0,2.37981935769669e-05,5.12811602422022e-05,7.76219782624343e-05,9.67594266641204e-05,0.000102402293003934,8.93446142180771e-05,5.48757001189492e-05,0,-6.98390822106801e-05,-0.000144796613236076,-0.000211584529177083,-0.000255350691065505,-0.000262287143743221,-0.000222588059270278,-0.000133232304956957,0,0.000161825787670552,0.000328461753850966,0.000470456115761849,0.000557138514575309,0.000562125651215187,0.000469019185539625,0.000276248668389530,0,-0.000325641794868386,-0.000651823102867104,-0.000921277873093193,-0.00107725343489436,-0.00107377277002735,-0.000885566453903926,-0.000515818960907655,0,0.000595487671937953,0.00118035587106610,0.00165273202703699,0.00191526793309656,0.00189273248053815,0.00154818703278779,0.000894706958349413,0,-0.00101782258782061,-0.00200374005520543,-0.00278743568241173,-0.00321032998802194,-0.00315406241179844,-0.00256571636519003,-0.00147507526421114,0,0.00166241654463785,0.00325911928390692,0.00451656858158677,0.00518389843461239,0.00507742646974599,0.00411925214141416,0.00236285754179665,0,-0.00265435078667592,-0.00519902510843334,-0.00720202382346569,-0.00826729281920074,-0.00810337395729563,-0.00658311153957022,-0.00378390404152924,0,0.00427812528511525,0.00841763585983202,0.0117256605746306,0.0135504766477887,0.0133881893699975,0.0109795012423413,0.00638127494168541,0,-0.00742122960415389,-0.0148645630434021,-0.0211435846221781,-0.0250427505875861,-0.0254735309425472,-0.0216273100178822,-0.0131043233832255,0,0.0170651339899805,0.0369789192644520,0.0582331806209396,0.0790720120814060,0.0976759987169523,0.112360459369509,0.121763435772877,0.125000000000000,0.121763435772877,0.112360459369509,0.0976759987169523,0.0790720120814060,0.0582331806209396,0.0369789192644520,0.0170651339899805,0,-0.0131043233832255,-0.0216273100178822,-0.0254735309425472,-0.0250427505875861,-0.0211435846221781,-0.0148645630434021,-0.00742122960415389,0,0.00638127494168541,0.0109795012423413,0.0133881893699975,0.0135504766477887,0.0117256605746306,0.00841763585983202,0.00427812528511525,0,-0.00378390404152924,-0.00658311153957022,-0.00810337395729563,-0.00826729281920074,-0.00720202382346569,-0.00519902510843334,-0.00265435078667592,0,0.00236285754179665,0.00411925214141416,0.00507742646974599,0.00518389843461239,0.00451656858158677,0.00325911928390692,0.00166241654463785,0,-0.00147507526421114,-0.00256571636519003,-0.00315406241179844,-0.00321032998802194,-0.00278743568241173,-0.00200374005520543,-0.00101782258782061,0,0.000894706958349413,0.00154818703278779,0.00189273248053815,0.00191526793309656,0.00165273202703699,0.00118035587106610,0.000595487671937953,0,-0.000515818960907655,-0.000885566453903926,-0.00107377277002735,-0.00107725343489436,-0.000921277873093193,-0.000651823102867104,-0.000325641794868386,0,0.000276248668389530,0.000469019185539625,0.000562125651215187,0.000557138514575309,0.000470456115761849,0.000328461753850966,0.000161825787670552,0,-0.000133232304956957,-0.000222588059270278,-0.000262287143743221,-0.000255350691065505,-0.000211584529177083,-0.000144796613236076,-6.98390822106801e-05,0,5.48757001189492e-05,8.93446142180771e-05,0.000102402293003934,9.67594266641204e-05,7.76219782624343e-05,5.12811602422022e-05,2.37981935769669e-05,0,-1.70942125588022e-05,-2.63968287932752e-05,-2.84942816906662e-05,-2.51345861356310e-05,-1.86102645020054e-05,-1.11776164088723e-05,-4.61831139920519e-06,0 \
  CONFIG.Coefficient_Fractional_Bits 17 \
  CONFIG.Coefficient_Sets 1 \
  CONFIG.Coefficient_Sign Signed \
  CONFIG.Coefficient_Structure Inferred \
  CONFIG.Coefficient_Width 16 \
  CONFIG.ColumnConfig 13 \
  CONFIG.Decimation_Rate 8 \
  CONFIG.Filter_Architecture Systolic_Multiply_Accumulate \
  CONFIG.Filter_Type Decimation \
  CONFIG.Interpolation_Rate 1 \
  CONFIG.Number_Channels 1 \
  CONFIG.Output_Rounding_Mode Truncate_LSBs \
  CONFIG.Output_Width 16 \
  CONFIG.Quantization Quantize_Only \
  CONFIG.RateSpecification Frequency_Specification \
  CONFIG.S_DATA_Has_FIFO false \
  CONFIG.Sample_Frequency 128 \
  CONFIG.Zero_Pack_Factor 1 \
] [get_bd_cells fir_decim_8_imag]

# ---- hierarchy /receiver/fir_decim_real ----
current_bd_instance /receiver/fir_decim_real
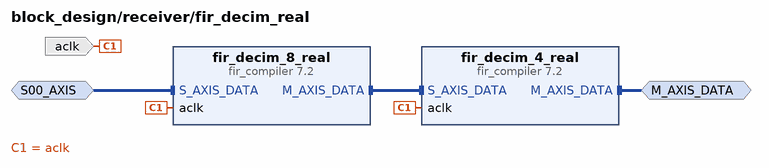
[diagram p3: block diagram inside /receiver/fir_decim_real]
create_bd_intf_pin -mode Master -vlnv xilinx.com:interface:axis_rtl:1.0 M_AXIS_DATA
create_bd_intf_pin -mode Slave -vlnv xilinx.com:interface:axis_rtl:1.0 S00_AXIS
create_bd_pin -dir I -type clk aclk

create_bd_cell -type ip -vlnv xilinx.com:ip:fir_compiler:7.2 fir_decim_4_real
set_property -dict [list \
  CONFIG.BestPrecision true \
  CONFIG.Clock_Frequency 128 \
  CONFIG.CoefficientVector 0,-2.23552328177445e-05,-5.02691722712620e-05,-5.27936575865503e-05,0,0.000102562320484404,0.000193518853328241,0.000178689228436154,0,-0.000289593226472151,-0.000510701382131011,-0.000445176118540556,0,0.000656923507701932,0.00111427702915062,0.000938038371079250,0,-0.00130364620573421,-0.00215450686978872,-0.00177113290780785,0,0.00236071174213220,0.00383053586619311,0.00309637406557559,0,-0.00400748011041086,-0.00642065997604389,-0.00513143273038007,0,0.00651823856781384,0.0103677968692248,0.00823850428282832,0,-0.0103980502168667,-0.0165345856384015,-0.0131662230791404,0,0.0168352717196640,0.0271009532955774,0.0219590024846825,0,-0.0297291260868043,-0.0500855011751722,-0.0432546200357644,0,0.0739578385289039,0.158144024162812,0.224720918739019,0.250000000000000,0.224720918739019,0.158144024162812,0.0739578385289039,0,-0.0432546200357644,-0.0500855011751722,-0.0297291260868043,0,0.0219590024846825,0.0271009532955774,0.0168352717196640,0,-0.0131662230791404,-0.0165345856384015,-0.0103980502168667,0,0.00823850428282832,0.0103677968692248,0.00651823856781384,0,-0.00513143273038007,-0.00642065997604389,-0.00400748011041086,0,0.00309637406557559,0.00383053586619311,0.00236071174213220,0,-0.00177113290780785,-0.00215450686978872,-0.00130364620573421,0,0.000938038371079250,0.00111427702915062,0.000656923507701932,0,-0.000445176118540556,-0.000510701382131011,-0.000289593226472151,0,0.000178689228436154,0.000193518853328241,0.000102562320484404,0,-5.27936575865503e-05,-5.02691722712620e-05,-2.23552328177445e-05,0 \
  CONFIG.Coefficient_Fractional_Bits 16 \
  CONFIG.Coefficient_Sets 1 \
  CONFIG.Coefficient_Sign Signed \
  CONFIG.Coefficient_Structure Inferred \
  CONFIG.Coefficient_Width 16 \
  CONFIG.ColumnConfig 2 \
  CONFIG.Decimation_Rate 4 \
  CONFIG.Filter_Architecture Systolic_Multiply_Accumulate \
  CONFIG.Filter_Type Decimation \
  CONFIG.Interpolation_Rate 1 \
  CONFIG.Number_Channels 1 \
  CONFIG.Output_Rounding_Mode Truncate_LSBs \
  CONFIG.Output_Width 16 \
  CONFIG.Quantization Quantize_Only \
  CONFIG.RateSpecification Frequency_Specification \
  CONFIG.S_DATA_Has_FIFO false \
  CONFIG.Sample_Frequency 16 \
  CONFIG.Zero_Pack_Factor 1 \
] [get_bd_cells fir_decim_4_real]
create_bd_cell -type ip -vlnv xilinx.com:ip:fir_compiler:7.2 fir_decim_8_real
set_property -dict [list \
  CONFIG.BestPrecision true \
  CONFIG.Clock_Frequency 128 \
  CONFIG.CoefficientVector 0,-4.61831139920519e-06,-1.11776164088723e-05,-1.86102645020054e-05,-2.51345861356310e-05,-2.84942816906662e-05,-2.63968287932752e-05,-1.70942125588022e-05,0,2.37981935769669e-05,5.12811602422022e-05,7.76219782624343e-05,9.67594266641204e-05,0.000102402293003934,8.93446142180771e-05,5.48757001189492e-05,0,-6.98390822106801e-05,-0.000144796613236076,-0.000211584529177083,-0.000255350691065505,-0.000262287143743221,-0.000222588059270278,-0.000133232304956957,0,0.000161825787670552,0.000328461753850966,0.000470456115761849,0.000557138514575309,0.000562125651215187,0.000469019185539625,0.000276248668389530,0,-0.000325641794868386,-0.000651823102867104,-0.000921277873093193,-0.00107725343489436,-0.00107377277002735,-0.000885566453903926,-0.000515818960907655,0,0.000595487671937953,0.00118035587106610,0.00165273202703699,0.00191526793309656,0.00189273248053815,0.00154818703278779,0.000894706958349413,0,-0.00101782258782061,-0.00200374005520543,-0.00278743568241173,-0.00321032998802194,-0.00315406241179844,-0.00256571636519003,-0.00147507526421114,0,0.00166241654463785,0.00325911928390692,0.00451656858158677,0.00518389843461239,0.00507742646974599,0.00411925214141416,0.00236285754179665,0,-0.00265435078667592,-0.00519902510843334,-0.00720202382346569,-0.00826729281920074,-0.00810337395729563,-0.00658311153957022,-0.00378390404152924,0,0.00427812528511525,0.00841763585983202,0.0117256605746306,0.0135504766477887,0.0133881893699975,0.0109795012423413,0.00638127494168541,0,-0.00742122960415389,-0.0148645630434021,-0.0211435846221781,-0.0250427505875861,-0.0254735309425472,-0.0216273100178822,-0.0131043233832255,0,0.0170651339899805,0.0369789192644520,0.0582331806209396,0.0790720120814060,0.0976759987169523,0.112360459369509,0.121763435772877,0.125000000000000,0.121763435772877,0.112360459369509,0.0976759987169523,0.0790720120814060,0.0582331806209396,0.0369789192644520,0.0170651339899805,0,-0.0131043233832255,-0.0216273100178822,-0.0254735309425472,-0.0250427505875861,-0.0211435846221781,-0.0148645630434021,-0.00742122960415389,0,0.00638127494168541,0.0109795012423413,0.0133881893699975,0.0135504766477887,0.0117256605746306,0.00841763585983202,0.00427812528511525,0,-0.00378390404152924,-0.00658311153957022,-0.00810337395729563,-0.00826729281920074,-0.00720202382346569,-0.00519902510843334,-0.00265435078667592,0,0.00236285754179665,0.00411925214141416,0.00507742646974599,0.00518389843461239,0.00451656858158677,0.00325911928390692,0.00166241654463785,0,-0.00147507526421114,-0.00256571636519003,-0.00315406241179844,-0.00321032998802194,-0.00278743568241173,-0.00200374005520543,-0.00101782258782061,0,0.000894706958349413,0.00154818703278779,0.00189273248053815,0.00191526793309656,0.00165273202703699,0.00118035587106610,0.000595487671937953,0,-0.000515818960907655,-0.000885566453903926,-0.00107377277002735,-0.00107725343489436,-0.000921277873093193,-0.000651823102867104,-0.000325641794868386,0,0.000276248668389530,0.000469019185539625,0.000562125651215187,0.000557138514575309,0.000470456115761849,0.000328461753850966,0.000161825787670552,0,-0.000133232304956957,-0.000222588059270278,-0.000262287143743221,-0.000255350691065505,-0.000211584529177083,-0.000144796613236076,-6.98390822106801e-05,0,5.48757001189492e-05,8.93446142180771e-05,0.000102402293003934,9.67594266641204e-05,7.76219782624343e-05,5.12811602422022e-05,2.37981935769669e-05,0,-1.70942125588022e-05,-2.63968287932752e-05,-2.84942816906662e-05,-2.51345861356310e-05,-1.86102645020054e-05,-1.11776164088723e-05,-4.61831139920519e-06,0 \
  CONFIG.Coefficient_Fractional_Bits 17 \
  CONFIG.Coefficient_Sets 1 \
  CONFIG.Coefficient_Sign Signed \
  CONFIG.Coefficient_Structure Inferred \
  CONFIG.Coefficient_Width 16 \
  CONFIG.ColumnConfig 13 \
  CONFIG.Decimation_Rate 8 \
  CONFIG.Filter_Architecture Systolic_Multiply_Accumulate \
  CONFIG.Filter_Type Decimation \
  CONFIG.Interpolation_Rate 1 \
  CONFIG.Number_Channels 1 \
  CONFIG.Output_Rounding_Mode Truncate_LSBs \
  CONFIG.Output_Width 16 \
  CONFIG.Quantization Quantize_Only \
  CONFIG.RateSpecification Frequency_Specification \
  CONFIG.S_DATA_Has_FIFO false \
  CONFIG.Sample_Frequency 128 \
  CONFIG.Zero_Pack_Factor 1 \
] [get_bd_cells fir_decim_8_real]

# ---- hierarchy /transmitter ----
current_bd_instance /transmitter
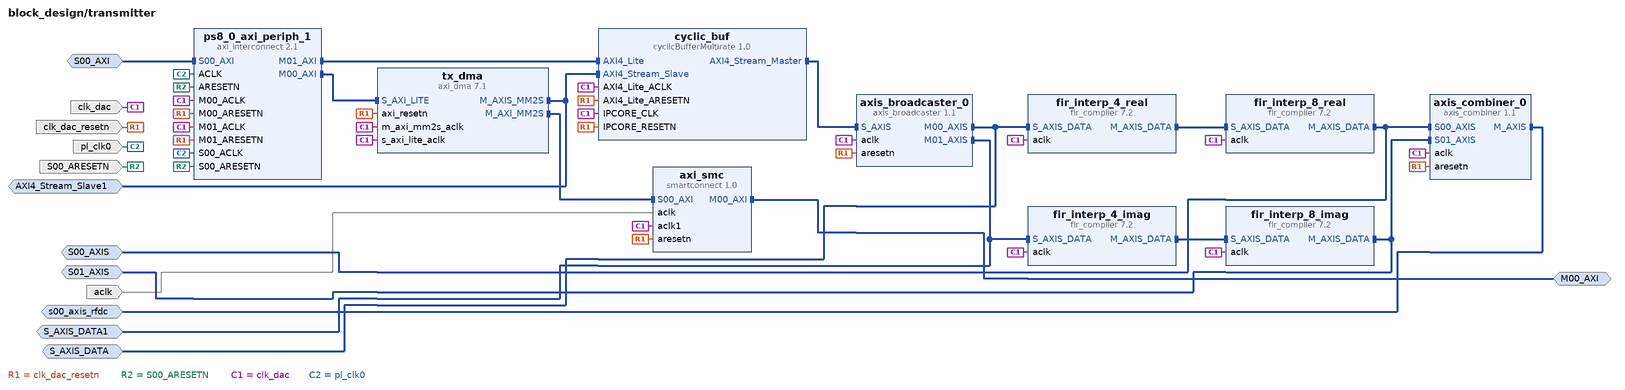
[diagram p4: block diagram inside /transmitter]
create_bd_intf_pin -mode Monitor -vlnv xilinx.com:interface:axis_rtl:1.0 AXI4_Stream_Slave1
create_bd_intf_pin -mode Master -vlnv xilinx.com:interface:aximm_rtl:1.0 M00_AXI
create_bd_intf_pin -mode Slave -vlnv xilinx.com:interface:aximm_rtl:1.0 S00_AXI
create_bd_intf_pin -mode Monitor -vlnv xilinx.com:interface:axis_rtl:1.0 S00_AXIS
create_bd_intf_pin -mode Monitor -vlnv xilinx.com:interface:axis_rtl:1.0 S01_AXIS
create_bd_intf_pin -mode Monitor -vlnv xilinx.com:interface:axis_rtl:1.0 S_AXIS_DATA
create_bd_intf_pin -mode Monitor -vlnv xilinx.com:interface:axis_rtl:1.0 S_AXIS_DATA1
create_bd_intf_pin -mode Monitor -vlnv xilinx.com:interface:axis_rtl:1.0 s00_axis_rfdc
create_bd_pin -dir I -type rst S00_ARESETN
create_bd_pin -dir I -type clk aclk
create_bd_pin -dir I -type clk clk_dac
create_bd_pin -dir I -type rst clk_dac_resetn
create_bd_pin -dir I -type clk pl_clk0

create_bd_cell -type ip -vlnv xilinx.com:ip:smartconnect:1.0 axi_smc
set_property -dict {CONFIG.NUM_CLKS 2 CONFIG.NUM_SI 1} [get_bd_cells axi_smc]
create_bd_cell -type ip -vlnv xilinx.com:ip:axis_broadcaster:1.1 axis_broadcaster_0
set_property -dict [list \
  CONFIG.M00_TDATA_REMAP {tdata[15:0]} \
  CONFIG.M01_TDATA_REMAP {tdata[15:0]} \
  CONFIG.M_TDATA_NUM_BYTES 2 \
  CONFIG.S_TDATA_NUM_BYTES 4 \
] [get_bd_cells axis_broadcaster_0]
create_bd_cell -type ip -vlnv xilinx.com:ip:axis_combiner:1.1 axis_combiner_0
create_bd_cell -type ip -vlnv user.org:ip:cyclicBufferMultirate:1.0 cyclic_buf
create_bd_cell -type ip -vlnv xilinx.com:ip:fir_compiler:7.2 fir_interp_4_imag
set_property -dict [list \
  CONFIG.BestPrecision false \
  CONFIG.Clock_Frequency 128 \
  CONFIG.CoefficientVector 0,-2.23552328177445e-05,-5.02691722712620e-05,-5.27936575865503e-05,0,0.000102562320484404,0.000193518853328241,0.000178689228436154,0,-0.000289593226472151,-0.000510701382131011,-0.000445176118540556,0,0.000656923507701932,0.00111427702915062,0.000938038371079250,0,-0.00130364620573421,-0.00215450686978872,-0.00177113290780785,0,0.00236071174213220,0.00383053586619311,0.00309637406557559,0,-0.00400748011041086,-0.00642065997604389,-0.00513143273038007,0,0.00651823856781384,0.0103677968692248,0.00823850428282832,0,-0.0103980502168667,-0.0165345856384015,-0.0131662230791404,0,0.0168352717196640,0.0271009532955774,0.0219590024846825,0,-0.0297291260868043,-0.0500855011751722,-0.0432546200357644,0,0.0739578385289039,0.158144024162812,0.224720918739019,0.250000000000000,0.224720918739019,0.158144024162812,0.0739578385289039,0,-0.0432546200357644,-0.0500855011751722,-0.0297291260868043,0,0.0219590024846825,0.0271009532955774,0.0168352717196640,0,-0.0131662230791404,-0.0165345856384015,-0.0103980502168667,0,0.00823850428282832,0.0103677968692248,0.00651823856781384,0,-0.00513143273038007,-0.00642065997604389,-0.00400748011041086,0,0.00309637406557559,0.00383053586619311,0.00236071174213220,0,-0.00177113290780785,-0.00215450686978872,-0.00130364620573421,0,0.000938038371079250,0.00111427702915062,0.000656923507701932,0,-0.000445176118540556,-0.000510701382131011,-0.000289593226472151,0,0.000178689228436154,0.000193518853328241,0.000102562320484404,0,-5.27936575865503e-05,-5.02691722712620e-05,-2.23552328177445e-05,0 \
  CONFIG.Coefficient_Fractional_Bits 16 \
  CONFIG.Coefficient_Sets 1 \
  CONFIG.Coefficient_Sign Signed \
  CONFIG.Coefficient_Structure Inferred \
  CONFIG.Coefficient_Width 16 \
  CONFIG.ColumnConfig 2 \
  CONFIG.Decimation_Rate 1 \
  CONFIG.Filter_Architecture Systolic_Multiply_Accumulate \
  CONFIG.Filter_Type Interpolation \
  CONFIG.Interpolation_Rate 4 \
  CONFIG.Number_Channels 1 \
  CONFIG.Output_Rounding_Mode Truncate_LSBs \
  CONFIG.Output_Width 16 \
  CONFIG.Quantization Quantize_Only \
  CONFIG.RateSpecification Frequency_Specification \
  CONFIG.S_DATA_Has_FIFO false \
  CONFIG.Sample_Frequency 4 \
  CONFIG.Zero_Pack_Factor 1 \
] [get_bd_cells fir_interp_4_imag]
create_bd_cell -type ip -vlnv xilinx.com:ip:fir_compiler:7.2 fir_interp_4_real
set_property -dict [list \
  CONFIG.BestPrecision false \
  CONFIG.Clock_Frequency 128 \
  CONFIG.CoefficientVector 0,-2.23552328177445e-05,-5.02691722712620e-05,-5.27936575865503e-05,0,0.000102562320484404,0.000193518853328241,0.000178689228436154,0,-0.000289593226472151,-0.000510701382131011,-0.000445176118540556,0,0.000656923507701932,0.00111427702915062,0.000938038371079250,0,-0.00130364620573421,-0.00215450686978872,-0.00177113290780785,0,0.00236071174213220,0.00383053586619311,0.00309637406557559,0,-0.00400748011041086,-0.00642065997604389,-0.00513143273038007,0,0.00651823856781384,0.0103677968692248,0.00823850428282832,0,-0.0103980502168667,-0.0165345856384015,-0.0131662230791404,0,0.0168352717196640,0.0271009532955774,0.0219590024846825,0,-0.0297291260868043,-0.0500855011751722,-0.0432546200357644,0,0.0739578385289039,0.158144024162812,0.224720918739019,0.250000000000000,0.224720918739019,0.158144024162812,0.0739578385289039,0,-0.0432546200357644,-0.0500855011751722,-0.0297291260868043,0,0.0219590024846825,0.0271009532955774,0.0168352717196640,0,-0.0131662230791404,-0.0165345856384015,-0.0103980502168667,0,0.00823850428282832,0.0103677968692248,0.00651823856781384,0,-0.00513143273038007,-0.00642065997604389,-0.00400748011041086,0,0.00309637406557559,0.00383053586619311,0.00236071174213220,0,-0.00177113290780785,-0.00215450686978872,-0.00130364620573421,0,0.000938038371079250,0.00111427702915062,0.000656923507701932,0,-0.000445176118540556,-0.000510701382131011,-0.000289593226472151,0,0.000178689228436154,0.000193518853328241,0.000102562320484404,0,-5.27936575865503e-05,-5.02691722712620e-05,-2.23552328177445e-05,0 \
  CONFIG.Coefficient_Fractional_Bits 16 \
  CONFIG.Coefficient_Sets 1 \
  CONFIG.Coefficient_Sign Signed \
  CONFIG.Coefficient_Structure Inferred \
  CONFIG.Coefficient_Width 16 \
  CONFIG.ColumnConfig 2 \
  CONFIG.Decimation_Rate 1 \
  CONFIG.Filter_Architecture Systolic_Multiply_Accumulate \
  CONFIG.Filter_Type Interpolation \
  CONFIG.Interpolation_Rate 4 \
  CONFIG.Number_Channels 1 \
  CONFIG.Output_Rounding_Mode Truncate_LSBs \
  CONFIG.Output_Width 16 \
  CONFIG.Quantization Quantize_Only \
  CONFIG.RateSpecification Frequency_Specification \
  CONFIG.S_DATA_Has_FIFO false \
  CONFIG.Sample_Frequency 4 \
  CONFIG.Zero_Pack_Factor 1 \
] [get_bd_cells fir_interp_4_real]
create_bd_cell -type ip -vlnv xilinx.com:ip:fir_compiler:7.2 fir_interp_8_imag
set_property -dict [list \
  CONFIG.BestPrecision true \
  CONFIG.Clock_Frequency 128 \
  CONFIG.CoefficientVector 0,-4.61831139920519e-06,-1.11776164088723e-05,-1.86102645020054e-05,-2.51345861356310e-05,-2.84942816906662e-05,-2.63968287932752e-05,-1.70942125588022e-05,0,2.37981935769669e-05,5.12811602422022e-05,7.76219782624343e-05,9.67594266641204e-05,0.000102402293003934,8.93446142180771e-05,5.48757001189492e-05,0,-6.98390822106801e-05,-0.000144796613236076,-0.000211584529177083,-0.000255350691065505,-0.000262287143743221,-0.000222588059270278,-0.000133232304956957,0,0.000161825787670552,0.000328461753850966,0.000470456115761849,0.000557138514575309,0.000562125651215187,0.000469019185539625,0.000276248668389530,0,-0.000325641794868386,-0.000651823102867104,-0.000921277873093193,-0.00107725343489436,-0.00107377277002735,-0.000885566453903926,-0.000515818960907655,0,0.000595487671937953,0.00118035587106610,0.00165273202703699,0.00191526793309656,0.00189273248053815,0.00154818703278779,0.000894706958349413,0,-0.00101782258782061,-0.00200374005520543,-0.00278743568241173,-0.00321032998802194,-0.00315406241179844,-0.00256571636519003,-0.00147507526421114,0,0.00166241654463785,0.00325911928390692,0.00451656858158677,0.00518389843461239,0.00507742646974599,0.00411925214141416,0.00236285754179665,0,-0.00265435078667592,-0.00519902510843334,-0.00720202382346569,-0.00826729281920074,-0.00810337395729563,-0.00658311153957022,-0.00378390404152924,0,0.00427812528511525,0.00841763585983202,0.0117256605746306,0.0135504766477887,0.0133881893699975,0.0109795012423413,0.00638127494168541,0,-0.00742122960415389,-0.0148645630434021,-0.0211435846221781,-0.0250427505875861,-0.0254735309425472,-0.0216273100178822,-0.0131043233832255,0,0.0170651339899805,0.0369789192644520,0.0582331806209396,0.0790720120814060,0.0976759987169523,0.112360459369509,0.121763435772877,0.125000000000000,0.121763435772877,0.112360459369509,0.0976759987169523,0.0790720120814060,0.0582331806209396,0.0369789192644520,0.0170651339899805,0,-0.0131043233832255,-0.0216273100178822,-0.0254735309425472,-0.0250427505875861,-0.0211435846221781,-0.0148645630434021,-0.00742122960415389,0,0.00638127494168541,0.0109795012423413,0.0133881893699975,0.0135504766477887,0.0117256605746306,0.00841763585983202,0.00427812528511525,0,-0.00378390404152924,-0.00658311153957022,-0.00810337395729563,-0.00826729281920074,-0.00720202382346569,-0.00519902510843334,-0.00265435078667592,0,0.00236285754179665,0.00411925214141416,0.00507742646974599,0.00518389843461239,0.00451656858158677,0.00325911928390692,0.00166241654463785,0,-0.00147507526421114,-0.00256571636519003,-0.00315406241179844,-0.00321032998802194,-0.00278743568241173,-0.00200374005520543,-0.00101782258782061,0,0.000894706958349413,0.00154818703278779,0.00189273248053815,0.00191526793309656,0.00165273202703699,0.00118035587106610,0.000595487671937953,0,-0.000515818960907655,-0.000885566453903926,-0.00107377277002735,-0.00107725343489436,-0.000921277873093193,-0.000651823102867104,-0.000325641794868386,0,0.000276248668389530,0.000469019185539625,0.000562125651215187,0.000557138514575309,0.000470456115761849,0.000328461753850966,0.000161825787670552,0,-0.000133232304956957,-0.000222588059270278,-0.000262287143743221,-0.000255350691065505,-0.000211584529177083,-0.000144796613236076,-6.98390822106801e-05,0,5.48757001189492e-05,8.93446142180771e-05,0.000102402293003934,9.67594266641204e-05,7.76219782624343e-05,5.12811602422022e-05,2.37981935769669e-05,0,-1.70942125588022e-05,-2.63968287932752e-05,-2.84942816906662e-05,-2.51345861356310e-05,-1.86102645020054e-05,-1.11776164088723e-05,-4.61831139920519e-06,0 \
  CONFIG.Coefficient_Fractional_Bits 17 \
  CONFIG.Coefficient_Sets 1 \
  CONFIG.Coefficient_Sign Signed \
  CONFIG.Coefficient_Structure Inferred \
  CONFIG.Coefficient_Width 16 \
  CONFIG.ColumnConfig 13 \
  CONFIG.Decimation_Rate 1 \
  CONFIG.Filter_Architecture Systolic_Multiply_Accumulate \
  CONFIG.Filter_Type Interpolation \
  CONFIG.Interpolation_Rate 8 \
  CONFIG.Number_Channels 1 \
  CONFIG.Output_Rounding_Mode Truncate_LSBs \
  CONFIG.Output_Width 16 \
  CONFIG.Quantization Quantize_Only \
  CONFIG.RateSpecification Frequency_Specification \
  CONFIG.S_DATA_Has_FIFO false \
  CONFIG.Sample_Frequency 16 \
  CONFIG.Zero_Pack_Factor 1 \
] [get_bd_cells fir_interp_8_imag]
create_bd_cell -type ip -vlnv xilinx.com:ip:fir_compiler:7.2 fir_interp_8_real
